# EAGLE design CT_main (EAGLE 9.6.2)
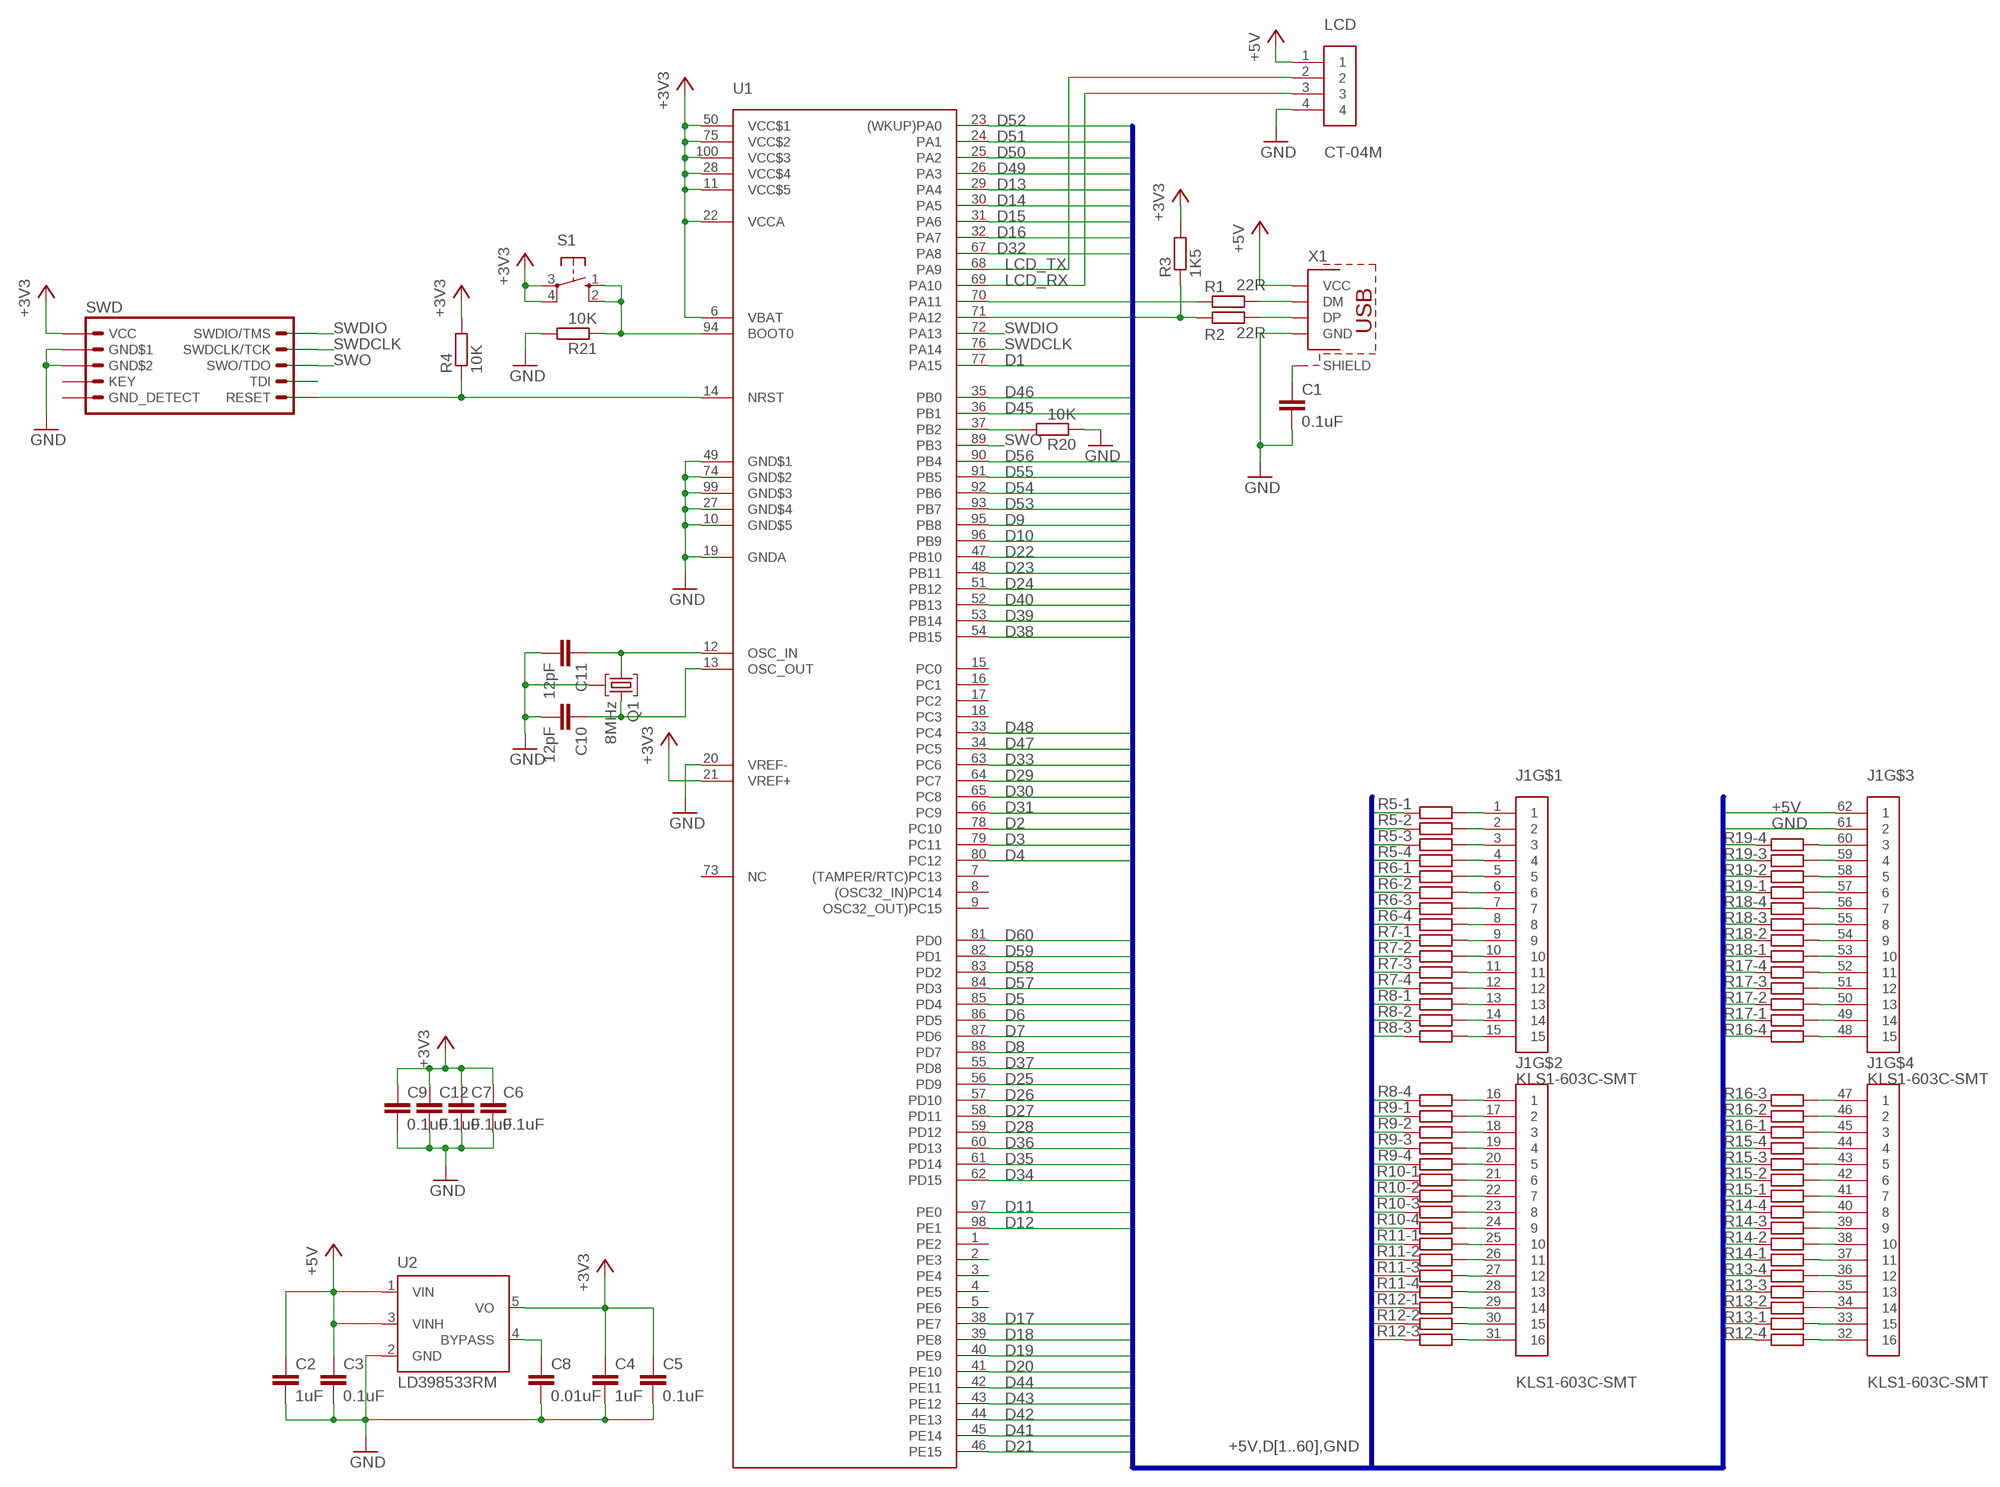
[diagram p0: schematic, sheet 1]

## Parts
C1  0.1uF  C-EU_0603  [C0603]
C2  1uF  C-EU_0603  [C0603]
C3  0.1uF  C-EU_0603  [C0603]
C4  1uF  C-EU_0603  [C0603]
C5  0.1uF  C-EU_0603  [C0603]
C6  0.1uF  C-EU_0603  [C0603]
C7  0.1uF  C-EU_0603  [C0603]
C8  0.01uF  C-EU_0603  [C0603]
C9  0.1uF  C-EU_0603  [C0603]
C10  12pF  C-EU_0603  [C0603]
C11  12pF  C-EU_0603  [C0603]
C12  0.1uF  C-EU_0603  [C0603]
J1  KLS1-603C-SMT  [KLS1-603C-SMT]
LCD  CT-04M  [CT-04M]
Q1  8MHz  CRYSTALKX-7_12.XXXXX  [KX-7_12.XXXXX]
R1  22R  R-EU__0603  [R0603]
R2  22R  R-EU__0603  [R0603]
R3  1K5  R-EU__0603  [R0603]
R4  10K  R-EU__0603  [R0603]
R5  R_EU_4_R1206  [R1206_4]
R6  R_EU_4_R1206  [R1206_4]
R7  R_EU_4_R1206  [R1206_4]
R8  R_EU_4_R1206  [R1206_4]
R9  R_EU_4_R1206  [R1206_4]
R10  R_EU_4_R1206  [R1206_4]
R11  R_EU_4_R1206  [R1206_4]
R12  R_EU_4_R1206  [R1206_4]
R13  R_EU_4_R1206  [R1206_4]
R14  R_EU_4_R1206  [R1206_4]
R15  R_EU_4_R1206  [R1206_4]
R16  R_EU_4_R1206  [R1206_4]
R17  R_EU_4_R1206  [R1206_4]
R18  R_EU_4_R1206  [R1206_4]
R19  R_EU_4_R1206  [R1206_4]
R20  10K  R-EU__0603  [R0603]
R21  10K  R-EU__0603  [R0603]
S1  10-XXDTSM-20  [DTSM20]
SWD  JTAG/SWD_10PIN  [ML10]
U1  STM32F1xx  STM32F101XX-LQFP100  [LQFP100]
U2  LD398533RM  [SOT23-5L]
X1  USBMICRO-B  [MOLEX-47364-0001]

## Nets
+3V3: C4.1 C5.1 C6.1 C7.1 C9.1 C12.1 R3.2 R4.2 S1.3(P) S1.4(P1) SWD.1(VCC) U1.6(VBAT) U1.11(VCC$5) U1.21(VREF+) U1.22(VCCA) U1.28(VCC$4) U1.50(VCC$1) U1.75(VCC$2) U1.100(VCC$3) U2.5(VO)
+5V: C2.1 C3.1 J1.62 LCD.1 U2.1(VIN) U2.3(VINH) X1.1(VCC)
D1: R5.8 U1.77(PA15)
D2: R5.7 U1.78(PC10)
D3: R5.6 U1.79(PC11)
D4: R5.5 U1.80(PC12)
D5: R6.8 U1.85(PD4)
D6: R6.7 U1.86(PD5)
D7: R6.6 U1.87(PD6)
D8: R6.5 U1.88(PD7)
D9: R7.8 U1.95(PB8)
D10: R7.7 U1.96(PB9)
D11: R7.6 U1.97(PE0)
D12: R7.5 U1.98(PE1)
D13: R8.8 U1.29(PA4)
D14: R8.7 U1.30(PA5)
D15: R8.6 U1.31(PA6)
D16: R8.5 U1.32(PA7)
D17: R9.8 U1.38(PE7)
D18: R9.7 U1.39(PE8)
D19: R9.6 U1.40(PE9)
D20: R9.5 U1.41(PE10)
D21: R10.8 U1.46(PE15)
D22: R10.7 U1.47(PB10)
D23: R10.6 U1.48(PB11)
D24: R10.5 U1.51(PB12)
D25: R11.8 U1.56(PD9)
D26: R11.7 U1.57(PD10)
D27: R11.6 U1.58(PD11)
D28: R11.5 U1.59(PD12)
D29: R12.8 U1.64(PC7)
D30: R12.7 U1.65(PC8)
D31: R12.6 U1.66(PC9)
D32: R12.5 U1.67(PA8)
D33: R13.1 U1.63(PC6)
D34: R13.2 U1.62(PD15)
D35: R13.3 U1.61(PD14)
D36: R13.4 U1.60(PD13)
D37: R14.1 U1.55(PD8)
D38: R14.2 U1.54(PB15)
D39: R14.3 U1.53(PB14)
D40: R14.4 U1.52(PB13)
D41: R15.1 U1.45(PE14)
D42: R15.2 U1.44(PE13)
D43: R15.3 U1.43(PE12)
D44: R15.4 U1.42(PE11)
D45: R16.1 U1.36(PB1)
D46: R16.2 U1.35(PB0)
D47: R16.3 U1.34(PC5)
D48: R16.4 U1.33(PC4)
D49: R17.1 U1.26(PA3)
D50: R17.2 U1.25(PA2)
D51: R17.3 U1.24(PA1)
D52: R17.4 U1.23((WKUP)PA0)
D53: R18.1 U1.93(PB7)
D54: R18.2 U1.92(PB6)
D55: R18.3 U1.91(PB5)
D56: R18.4 U1.90(PB4)
D57: R19.1 U1.84(PD3)
D58: R19.2 U1.83(PD2)
D59: R19.3 U1.82(PD1)
D60: R19.4 U1.81(PD0)
GND: C1.2 C2.2 C3.2 C4.2 C5.2 C6.2 C7.2 C8.2 C9.2 C10.2 C11.2 C12.2 J1.61 LCD.4 Q1.2 Q1.4 R20.1 R21.2 SWD.3(GND$1) SWD.5(GND$2) U1.10(GND$5) U1.19(GNDA) U1.20(VREF-) U1.27(GND$4) U1.49(GND$1) U1.74(GND$2) U1.99(GND$3) U2.2(GND) X1.5(GND)
LCD_RX: LCD.3 U1.69(PA10)
LCD_TX: LCD.2 U1.68(PA9)
N$1: R1.2 X1.2(DM)
N$2: R2.2 X1.3(DP)
N$3: C8.1 U2.4(BYPASS)
N$4: J1.1 R5.1
N$5: R1.1 U1.70(PA11)
N$6: R2.1 R3.1 U1.71(PA12)
N$7: R4.1 SWD.10(RESET) U1.14(NRST)
N$8: C10.1 Q1.3 U1.13(OSC_OUT)
N$9: C11.1 Q1.1 U1.12(OSC_IN)
N$10: J1.2 R5.2
N$11: J1.3 R5.3
N$12: J1.4 R5.4
N$13: J1.8 R6.4
N$14: J1.7 R6.3
N$15: J1.6 R6.2
N$16: J1.5 R6.1
N$17: J1.9 R7.1
N$18: J1.10 R7.2
N$19: J1.11 R7.3
N$20: J1.12 R7.4
N$21: J1.13 R8.1
N$22: J1.17 R9.1
N$23: J1.18 R9.2
N$24: J1.19 R9.3
N$25: J1.20 R9.4
N$26: J1.21 R10.1
N$27: J1.22 R10.2
N$28: J1.23 R10.3
N$29: J1.27 R11.3
N$30: J1.28 R11.4
N$31: J1.29 R12.1
N$32: J1.30 R12.2
N$33: J1.31 R12.3
N$34: J1.26 R11.2
N$35: J1.25 R11.1
N$36: J1.24 R10.4
N$37: J1.14 R8.2
N$38: J1.15 R8.3
N$39: J1.16 R8.4
N$40: J1.32 R12.4
N$41: J1.33 R13.8
N$42: J1.34 R13.7
N$43: J1.35 R13.6
N$44: J1.36 R13.5
N$45: J1.37 R14.8
N$46: J1.38 R14.7
N$47: J1.39 R14.6
N$48: J1.40 R14.5
N$49: J1.41 R15.8
N$50: J1.42 R15.7
N$51: J1.43 R15.6
N$52: J1.44 R15.5
N$53: J1.45 R16.8
N$54: J1.46 R16.7
N$55: J1.47 R16.6
N$56: J1.60 R19.5
N$57: J1.59 R19.6
N$58: J1.58 R19.7
N$59: J1.57 R19.8
N$60: J1.56 R18.5
N$61: J1.55 R18.6
N$62: J1.54 R18.7
N$63: J1.53 R18.8
N$64: J1.52 R17.5
N$65: J1.51 R17.6
N$66: J1.50 R17.7
N$67: J1.49 R17.8
N$68: J1.48 R16.5
N$73: R20.2 U1.37(PB2)
N$75: R21.1 S1.1(S) S1.2(S1) U1.94(BOOT0)
SHIELD: C1.1 X1.GND1(SHIELD) X1.GND2(SHIELD) X1.GND3(SHIELD) X1.GND4(SHIELD)
SWDCLK: SWD.4(SWDCLK/TCK) U1.76(PA14)
SWDIO: SWD.2(SWDIO/TMS) U1.72(PA13)
SWO: SWD.6(SWO/TDO) U1.89(PB3)
Unconnected: SWD.7(KEY) SWD.8(TDI) U1.1(PE2) U1.2(PE3) U1.3(PE4) U1.4(PE5) U1.5(PE6) U1.7((TAMPER/RTC)PC13) U1.8((OSC32_IN)PC14) U1.9(OSC32_OUT)PC15) U1.15(PC0) U1.16(PC1) U1.17(PC2) U1.18(PC3) U1.73(NC)

## Buses
+5V,D[1..60],GND

## Power pins joined to a net without a drawn wire
GND_DETECT: SWD.9(GND_DETECT)

## Library data of the parts
C1-C12 = snx_rlc:C-EU
J1 = snx_con:KLS1-603C
LCD = snx_con:CT-04
Q1 = snx_setup:CRYSTAL
R1-R4 R20 R21 = snx_rlc:R-EU_
R5-R19 = snx_rlc:R_EU_4
S1 = snx_btn:10-XX: OMRON SWITCH
SWD = snx_con:JTAG/SWD_10PIN; OC_FARNELL: unknown; OC_NEWARK: unknown
U1 = snx_stm32:STM32F101XX-LQFP100
U2 = snx_microchip:LD3985: Ultra low drop and low noise BiCMOS voltage regulators Source: www.st.com LD3985.pdf
X1 = snx_con:USB: USB-B connector

## Board
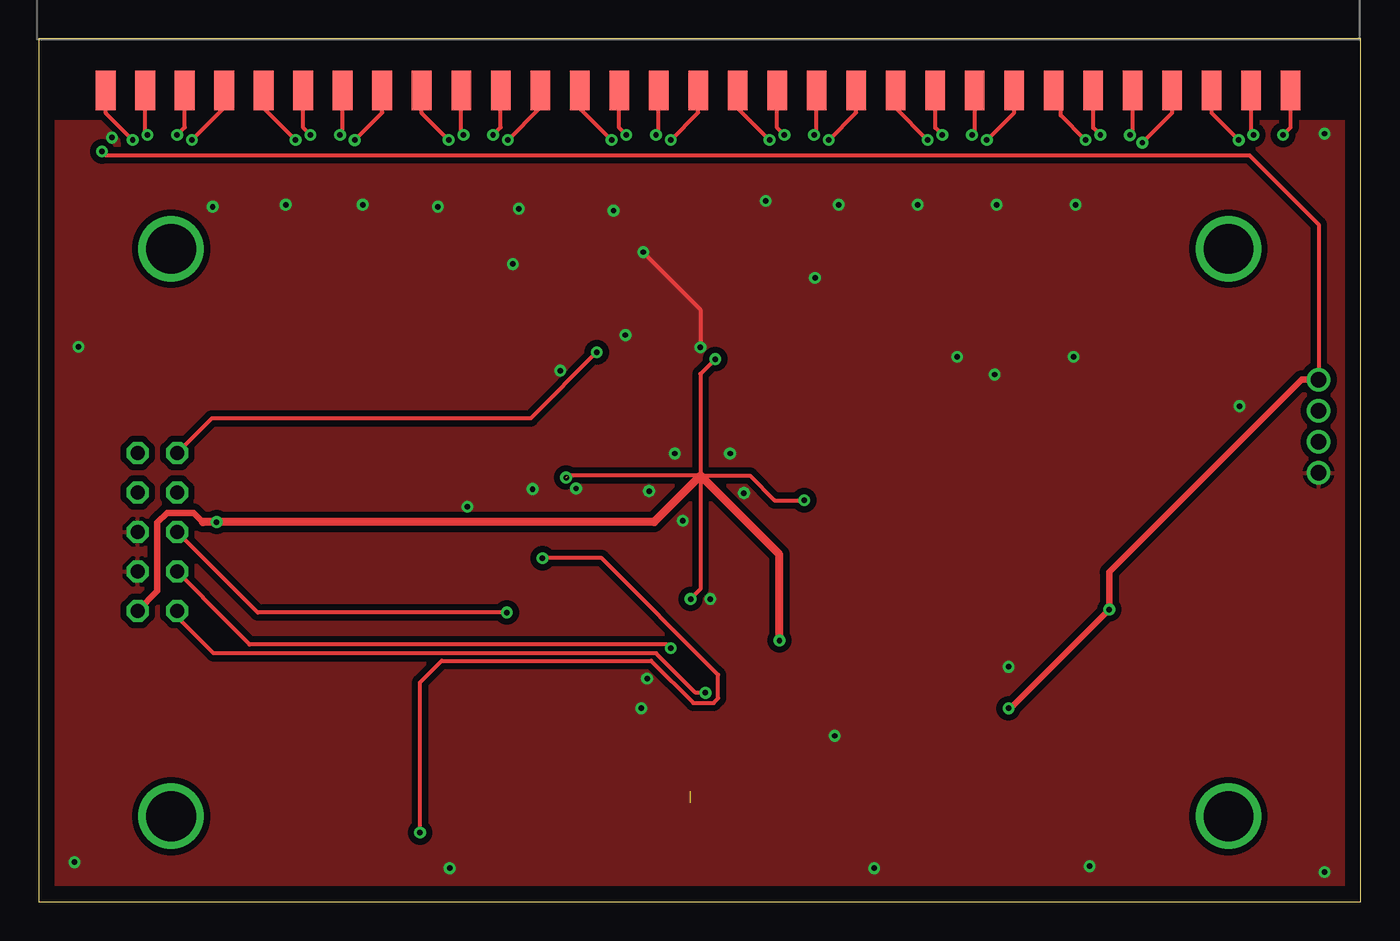
[diagram p1: board, top side]
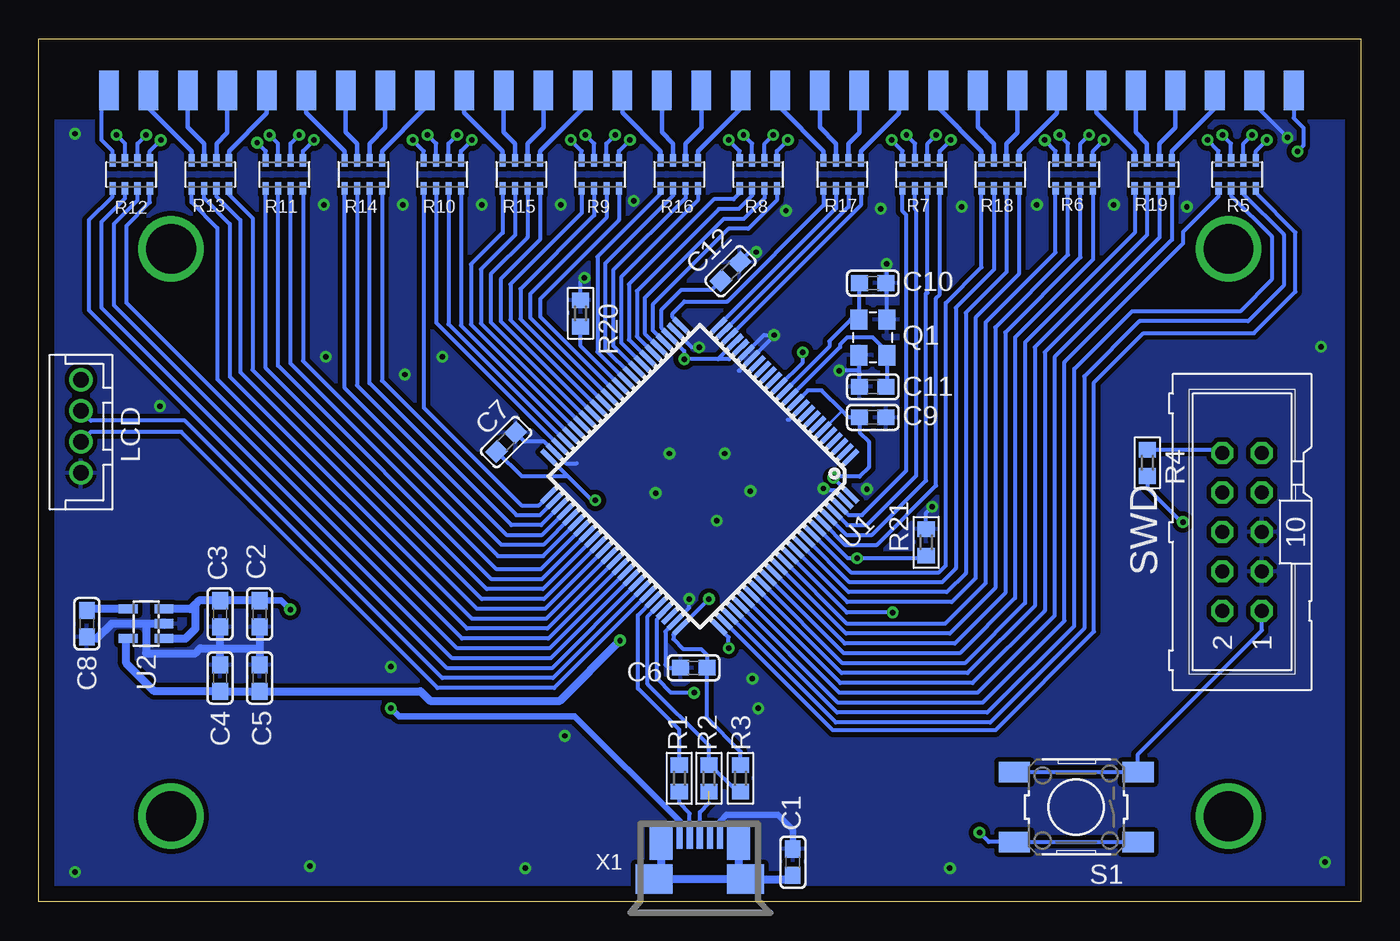
[diagram p2: board, bottom side, seen from below]

Size 85 x 55.5 mm. Coordinates in mm from the lower left corner, seen from the top.
Outline: 0,0 85,0 85,55.5 0,55.5 0,0
Copper layers (1*16): Top 0.035mm / dielectric 1.5mm / Bottom 0.035mm
Design rules "default": minimum track width 6mil, minimum drill 0.35mm, track to track 6mil, track to pad 6mil, pad to pad 6mil, via to via 6mil, smd to smd 6mil, copper to edge 40mil, drill to drill 6mil, minimum pad ring 10mil, minimum via ring 8mil, stop-mask expansion 4mil, vias tented up to drill 0mil, thermal gap 10mil

### Footprints (pad centres in the part's own frame; a part is rotated, then mirrored left to right if it is on the bottom)
C0603 = smd 1.1 x 1: 1 -0.85,0; 2 0.85,0
KLS1-603C-SMT = smd 1.27 x 2.54: 1 -38.1,0; 2 -35.56,0; 3 -33.02,0; 4 -30.48,0; 5 -27.94,0; 6 -25.4,0; 7 -22.86,0; 8 -20.32,0; 9 -17.78,0; 10 -15.24,0; 11 -12.7,0; 12 -10.16,0; 13 -7.62,0; 14 -5.08,0; 15 -2.54,0; 16 0,0; 17 2.54,0; 18 5.08,0; 19 7.62,0; 20 10.16,0; 21 12.7,0; 22 15.24,0; 23 17.78,0; 24 20.32,0; 25 22.86,0; 26 25.4,0; 27 27.94,0; 28 30.48,0; 29 33.02,0; 30 35.56,0; 31 38.1,0 | smd 1.27 x 2.54 bottom: 32 38.1,0; 33 35.56,0; 34 33.02,0; 35 30.48,0; 36 27.94,0; 37 25.4,0; 38 22.86,0; 39 20.32,0; 40 17.78,0; 41 15.24,0; 42 12.7,0; 43 10.16,0; 44 7.62,0; 45 5.08,0; 46 2.54,0; 47 0,0; 48 -2.54,0; 49 -5.08,0; 50 -7.62,0; 51 -10.16,0; 52 -12.7,0; 53 -15.24,0; 54 -17.78,0; 55 -20.32,0; 56 -22.86,0; 57 -25.4,0; 58 -27.94,0; 59 -30.48,0; 60 -33.02,0; 61 -35.56,0; 62 -38.1,0
CT-04M = drill 1: 1 -3,0; 2 -1,0; 3 1,0; 4 3,0
KX-7_12.XXXXX = smd 1.3 x 1.1: 1 -1.15,-0.9; 2 1.15,-0.9; 3 1.15,0.9; 4 -1.15,0.9
R0603 = smd 1 x 1.1: 1 -0.85,0; 2 0.85,0
R1206_4 = smd 0.4 x 0.8: 1 -1.2,-0.9; 2 -0.4,-0.9; 3 0.4,-0.9; 4 1.2,-0.9; 5 1.2,0.9; 6 0.4,0.9; 7 -0.4,0.9; 8 -1.2,0.9
DTSM20 = smd 2 x 1.3: 1 -3.975,2.25; 2 3.975,2.25; 3 -3.975,-2.25; 4 3.975,-2.25
ML10 = drill 0.914 octagon: 1 -5.08,-1.27; 2 -5.08,1.27; 3 -2.54,-1.27; 4 -2.54,1.27; 5 0,-1.27; 6 0,1.27; 7 2.54,-1.27; 8 2.54,1.27; 9 5.08,-1.27; 10 5.08,1.27
LQFP100 = smd 1.2 x 0.32: 1 -7.75,6; 2 -7.75,5.5; 3 -7.75,5; 4 -7.75,4.5; 5 -7.75,4; 6 -7.75,3.5; 7 -7.75,3; 8 -7.75,2.5; 9 -7.75,2; 10 -7.75,1.5; 11 -7.75,1; 12 -7.75,0.5; 13 -7.75,0; 14 -7.75,-0.5; 15 -7.75,-1; 16 -7.75,-1.5; 17 -7.75,-2; 18 -7.75,-2.5; 19 -7.75,-3; 20 -7.75,-3.5; 21 -7.75,-4; 22 -7.75,-4.5; 23 -7.75,-5; 24 -7.75,-5.5; 25 -7.75,-6; 51 7.75,-6; 52 7.75,-5.5; 53 7.75,-5; 54 7.75,-4.5; 55 7.75,-4; 56 7.75,-3.5; 57 7.75,-3; 58 7.75,-2.5; 59 7.75,-2; 60 7.75,-1.5; 61 7.75,-1; 62 7.75,-0.5; 63 7.75,0; 64 7.75,0.5; 65 7.75,1; 66 7.75,1.5; 67 7.75,2; 68 7.75,2.5; 69 7.75,3; 70 7.75,3.5; 71 7.75,4; 72 7.75,4.5; 73 7.75,5; 74 7.75,5.5; 75 7.75,6 | smd 0.32 x 1.2: 26 -6,-7.75; 27 -5.5,-7.75; 28 -5,-7.75; 29 -4.5,-7.75; 30 -4,-7.75; 31 -3.5,-7.75; 32 -3,-7.75; 33 -2.5,-7.75; 34 -2,-7.75; 35 -1.5,-7.75; 36 -1,-7.75; 37 -0.5,-7.75; 38 0,-7.75; 39 0.5,-7.75; 40 1,-7.75; 41 1.5,-7.75; 42 2,-7.75; 43 2.5,-7.75; 44 3,-7.75; 45 3.5,-7.75; 46 4,-7.75; 47 4.5,-7.75; 48 5,-7.75; 49 5.5,-7.75; 50 6,-7.75; 76 6,7.75; 77 5.5,7.75; 78 5,7.75; 79 4.5,7.75; 80 4,7.75; 81 3.5,7.75; 82 3,7.75; 83 2.5,7.75; 84 2,7.75; 85 1.5,7.75; 86 1,7.75; 87 0.5,7.75; 88 0,7.75; 89 -0.5,7.75; 90 -1,7.75; 91 -1.5,7.75; 92 -2,7.75; 93 -2.5,7.75; 94 -3,7.75; 95 -3.5,7.75; 96 -4,7.75; 97 -4.5,7.75; 98 -5,7.75; 99 -5.5,7.75; 100 -6,7.75
SOT23-5L = smd 0.6 x 1.2: 1 -0.95,-1.15; 2 0,-1.15; 3 0.95,-1.15; 4 0.95,1.15; 5 -0.95,1.15
MOLEX-47364-0001 = smd 1.7 x 0.4: 1 2.8,1.3; 2 2.8,0.65; 3 2.8,0; 4 2.8,-0.65; 5 2.8,-1.3 | smd 1.9 x 2.375: GND1 0,2.95; GND4 0,-2.95 | smd 2.1 x 1.475: GND2 2.3,2.5; GND3 2.3,-2.5

### Placement (x,y rotation side)
C1  36.51,2.54 90 bottom
C2  70.8,18.52 270 bottom
C3  73.34,18.52 270 bottom
C4  73.34,14.39 90 bottom
C5  70.8,14.39 90 bottom
C6  42.89,15.05 180 bottom
C7  54.96,29.57 45 bottom
C8  81.92,17.88 270 bottom
C9  31.37,31.16 0 bottom
C10  31.37,39.79 0 bottom
C11  31.37,33.12 180 bottom
C12  40.53,40.55 45 bottom
J1  42.4,52.17 0 top
LCD  82.3,30.58 270 bottom
Q1  31.37,36.3 90 bottom
R1  43.81,7.94 270 bottom
R2  41.91,7.94 270 bottom
R3  39.88,7.94 90 bottom
R4  13.72,28.24 270 bottom
R5  7.94,46.78 180 bottom
R6  18.41,46.78 180 bottom
R7  28.26,46.78 180 bottom
R8  38.73,46.78 180 bottom
R9  48.9,46.78 180 bottom
R10  59.05,46.78 180 bottom
R11  69.22,46.78 180 bottom
R12  79.06,46.78 180 bottom
R13  73.98,46.78 0 bottom
R14  64.14,46.78 0 bottom
R15  53.98,46.78 0 bottom
R16  43.81,46.78 0 bottom
R17  33.34,46.78 0 bottom
R18  23.18,46.78 0 bottom
R19  13.34,46.78 0 bottom
R20  50.16,37.85 270 bottom
R21  27.94,23.12 90 bottom
S1  18.29,6.1 180 bottom
SWD  7.62,23.79 90 bottom
U1  42.5,27.36 225 bottom
U2  78.11,17.88 90 bottom
X1  42.5,1.45 90 bottom

### Tracks (layer width: path | path; a pad name or v marks a point on that pad's centre or on a via)
+3V3  (via drill 0.35)  (1 unrouted)
  Top 0.254: v43.5,34.9 42.55,33.95 42.55,27.41 | 42.55,27.41 34.04,27.41 v33.91,27.28 | 42.55,27.41 45.72,27.41 47.31,25.82 v49.21,25.82 | 42.55,27.41 42.55,20.11 v41.91,19.47
  Top 0.406: SWD.1 7.62,19.98 7.62,24.39 8.26,25.02 9.95,25.02 10.54,24.43
  Top 0.508: v47.62,16.81 47.62,22.33 42.55,27.41 39.56,24.43 v11.43,24.43 10.54,24.43
  Bottom 0.203: U1.6 33.35,31.56 33.34,31.56
  Bottom 0.254: U1.50 50.99,27.37 | 50.99,27.37 49.44,25.82 v49.21,25.82 | v41.91,19.47 U1.75 44.2,17.18 44.2,16.89 43.56,16.26 42.42,16.26 42.04,15.88 C6.1 42.04,11.82 39.88,9.65 R3.2 | U1.100 34,27.35 | v33.91,27.28 33.91,27.35 32.22,27.35 31.62,27.94 31.62,29.59 32.22,30.19 C9.1 32.93,31.16 33.34,31.56 34.67,32.9 35.55,32.9 U1.11 | C12.1 41.71,39.37 43.69,39.37 44.96,38.1 44.96,36.89 U1.28 43.5,35.43 v43.5,34.9 41.33,34.9 | C7.1 53.95,27.37 50.99,27.37 | v11.43,24.43 11.52,24.43 13.72,26.62 R4.2 | S1.4 S1.3 14.31,9.49 6.35,17.45 SWD.1 | U1.22 41.33,34.9 | U1.21 40.62,34.9 41.33,34.9
  Bottom 0.508: U2.5 79.38,16.81 79.38,15.34 77.57,13.54 C4.1 C5.1 60.47,13.54 59.86,12.93 51.5,12.93 v47.62,16.81
+5V  (via drill 0.35)
  Top 0.254: v4.06,48.26 4.32,48.01 77.85,48.01 82.3,43.56 LCD.1
  Top 0.406: v62.36,12.45 62.48,12.45 v68.83,18.8 68.83,21.21 81.21,33.59 LCD.1
  Bottom 0.254: J1.62 4.3,50.4 3.68,49.79 3.68,48.64 v4.06,48.26
  Bottom 0.406: X1.1 43.8,5.19 50.55,11.94 61.85,11.94 v62.36,12.45 | v68.83,18.8 69.41,19.37 C2.1
  Bottom 0.508: C2.1 C3.1 74.72,19.37 74.93,19.15 | U2.3 75.25,18.83 74.93,19.15 | U2.1 75.56,16.93 74.93,17.57 74.93,19.15
D1
  Bottom 0.254: U1.77 33.94,11.03 23.5,11.03 17.14,17.38 17.14,33.4 13.97,36.58 6.86,36.58 4.19,39.25 4.19,43.06 6.74,45.6 R5.8
D2
  Bottom 0.254: U1.78 33.74,11.54 23.81,11.54 17.78,17.57 17.78,33.78 14.22,37.34 7.24,37.34 4.95,39.63 4.95,42.93 7.54,45.51 R5.7
D3
  Bottom 0.254: U1.79 33.67,12.17 24,12.17 18.41,17.76 18.41,34.27 14.71,37.98 7.75,37.98 5.71,40.01 5.71,42.8 8.34,45.42 R5.6
D4
  Bottom 0.254: U1.80 33.6,12.81 24.32,12.81 19.05,18.08 19.05,34.71 11.42,42.34 11.42,43.08 9.14,45.37 R5.5
D5
  Bottom 0.254: U1.85 33.24,15.98 25.78,15.98 22.23,19.54 22.23,36.3 17.21,41.31 R6.8
D6
  Bottom 0.254: U1.86 33.16,16.62 26.1,16.62 22.86,19.85 22.86,36.62 18.02,41.46 R6.7
D7
  Bottom 0.254: U1.87 33.09,17.25 26.42,17.25 23.5,20.17 23.5,36.93 18.82,41.61 R6.6
D8
  Bottom 0.254: U1.88 33.02,17.89 26.73,17.89 24.13,20.49 24.13,37.25 19.61,41.77 R6.5
D9
  Bottom 0.254: U1.95 33.15,22.96 31.11,22.96 27.3,26.78 27.3,38.82 27.06,39.06 R7.8
D10
  Bottom 0.254: U1.96 33.08,23.6 31.43,23.6 27.94,27.09 27.94,39.16 27.86,39.16 R7.7
D11
  Bottom 0.254: U1.97 33.01,24.24 31.75,24.24 28.57,27.41 28.57,44.46 28.66,44.54 R7.6
D12
  Bottom 0.254: U1.98 32.93,24.87 32.07,24.87 29.21,27.73 29.21,44.17 29.46,44.42 R7.5
D13
  Bottom 0.254: R8.8 37.53,45.12 39.37,43.28 40.64,43.28 45.53,38.4 45.53,36.76 U1.29
D14
  Bottom 0.254: R8.7 38.34,45.27 39.69,43.92 40.96,43.92 46.04,38.84 46.04,36.56 U1.30
D15
  Bottom 0.254: R8.6 39.13,45.42 40.01,44.56 41.27,44.56 46.55,39.28 46.55,36.36 U1.31
D16
  Bottom 0.254: R8.5 39.94,45.58 40.32,45.19 41.59,45.19 47.05,39.73 47.05,36.16 U1.32
D17
  Bottom 0.254: R9.8 47.7,43.85 52.77,38.78 52.77,37.63 U1.38
D18
  Bottom 0.254: R9.7 48.49,44 53.4,39.09 53.4,37.56 U1.39
D19
  Bottom 0.254: R9.6 49.3,44.16 54.04,39.41 54.04,37.49 U1.40
D20
  Bottom 0.254: R9.5 50.09,44.31 54.67,39.73 54.67,37.42 U1.41
D21
  Bottom 0.254: R10.8 57.85,37.06 U1.46
D22
  Bottom 0.254: R10.7 58.66,37.16 U1.47
D23
  Bottom 0.254: R10.6 59.45,37.25 U1.48
D24
  Bottom 0.254: R10.5 60.26,31.78 53.98,25.51 52.84,25.51 U1.51
D25
  Bottom 0.254: R11.8 68.02,34.78 55.47,22.24 52.57,22.24 U1.56
D26
  Bottom 0.254: U1.57 52.73,21.38 55.56,21.38 68.81,34.63 R11.7
D27
  Bottom 0.254: U1.58 52.66,20.74 55.88,20.74 69.61,34.48 R11.6
D28
  Bottom 0.254: U1.59 52.59,20.11 56.2,20.11 70.42,34.32 R11.5
D29
  Bottom 0.254: U1.64 52.23,16.93 57.78,16.93 79.38,38.53 79.38,43.46 77.86,44.99 R12.8
D30
  Bottom 0.254: U1.65 52.15,16.3 58.1,16.3 80.18,38.38 80.18,43.59 78.66,45.12 R12.7
D31
  Bottom 0.254: U1.66 52.08,15.66 58.42,15.66 80.98,38.22 80.98,43.72 79.46,45.24 R12.6
D32
  Bottom 0.254: U1.67 52.01,15.03 58.74,15.03 81.78,38.07 81.78,43.85 80.26,45.37 R12.5
D33
  Bottom 0.254: U1.63 52.3,17.57 57.47,17.57 73.53,33.63 73.53,43.34 75.18,44.99 R13.1
D34
  Bottom 0.254: U1.62 52.37,18.2 57.15,18.2 72.73,33.78 72.73,43.59 74.38,45.24 R13.2
D35
  Bottom 0.254: U1.61 52.44,18.84 56.83,18.84 72.05,34.06 72.05,43.85 73.58,45.37 R13.3
D36
  Bottom 0.254: U1.60 52.51,19.47 56.52,19.47 71.25,34.21 71.25,43.97 72.78,45.5 R13.4
D37
  Bottom 0.254: U1.55 52.56,22.96 55.24,22.96 65.33,33.06 R14.1
D38
  Bottom 0.254: R14.2 64.53,33.21 54.93,23.6 52.63,23.6 U1.54
D39
  Bottom 0.254: U1.53 52.7,24.24 54.61,24.24 63.73,33.36 R14.3
D40
  Bottom 0.254: R14.4 62.94,33.51 54.29,24.87 52.77,24.87 U1.52
D41
  Bottom 0.254: R15.1 55.17,43.04 57.21,41 57.21,37.13 U1.45
D42
  Bottom 0.254: R15.2 54.38,42.89 56.58,40.68 56.58,37.2 U1.44
D43
  Bottom 0.254: R15.3 53.58,42.73 55.94,40.36 55.94,37.27 U1.43
D44
  Bottom 0.254: R15.4 52.77,42.58 55.31,40.05 55.31,37.35 U1.42
D45
  Bottom 0.254: R16.1 45.02,45.56 49.09,41.49 49.09,35.36 U1.36
D46
  Bottom 0.254: R16.2 44.22,45.42 48.58,41.06 48.58,35.56 U1.35
D47
  Bottom 0.254: R16.3 43.41,45.27 48.07,40.62 48.07,35.76 U1.34
D48
  Bottom 0.254: R16.4 42.62,45.12 47.56,40.17 47.56,35.96 U1.33
D49
  Bottom 0.254: R17.1 34.54,44.8 40.73,38.61 43.48,38.61 44.24,37.85 44.24,37.6 U1.26
D50
  Bottom 0.254: U1.25 33.74,44.61 R17.2
D51
  Bottom 0.254: R17.3 32.94,44.71 U1.24
D52
  Bottom 0.254: R17.4 32.14,44.8 U1.23
D53
  Bottom 0.254: U1.93 32.79,21.19 27.11,21.19 26.67,21.63 26.67,38.52 24.38,40.81 R18.1
D54
  Bottom 0.254: R18.2 23.58,40.66 26.04,38.21 26.04,21.44 26.92,20.55 32.86,20.55 U1.92
D55
  Bottom 0.254: R18.3 22.78,40.51 25.4,37.89 25.4,21.12 26.61,19.92 32.93,19.92 U1.91
D56
  Bottom 0.254: R18.4 21.98,40.36 24.77,37.57 24.77,20.81 26.29,19.28 33,19.28 U1.90
D57
  Bottom 0.254: R19.1 14.54,43.04 21.59,35.98 21.59,19.22 25.46,15.34 33.31,15.34 U1.84
D58
  Bottom 0.254: R19.2 13.73,42.89 20.95,35.67 20.95,19.03 25.27,14.71 33.38,14.71 U1.83
D59
  Bottom 0.254: R19.3 12.94,42.73 20.32,35.35 20.32,18.71 24.96,14.07 33.45,14.07 U1.82
D60
  Bottom 0.254: R19.4 12.13,42.58 19.68,35.03 19.68,18.39 24.64,13.44 33.52,13.44 U1.81
GND  (via drill 0.35)
  Top 0.254: v38.86,41.79 42.55,38.1 v42.55,35.67
  Bottom 0.254: C10.2 30.47,39.74 Q1.2 30.47,37.2 | C11.2 32.22,34.04 | 32.22,34.04 32.22,35.1 Q1.4 32.27,35.4 | U1.27 43.02,35.67 v42.55,35.67 | U1.99 33.81,26.46 34.42,26.46 v34.54,26.58 | v43.18,19.47 43.18,18.91 U1.74 44.7,17.38 44.7,15.24 44.51,15.05 C6.2 | C12.2 39.3,41.79 v38.86,41.79 | 32.22,34.04 32.35,34.17 v33.53,34.17 | C10.2 30.61,39.88 | v30.48,41.02 30.48,39.83 C10.2 | J1.61 6.84,51.29 v4.7,49.15 | U1.10 36.75,30.99 36.83,30.99 | 40.01,34.17 39.94,34.17 U1.19 37.72,36.39 v37.72,36.45 38.36,36.45 U1.20 | C7.2 53.77,29.59 52.51,29.59 U1.49 51.11,28.2 50.42,28.2 | R20.1 50.16,39.88 v49.91,40.13 | R21.2 27.94,25.02 v27.56,25.4
  Bottom 0.406: X1.5 41.2,5.16 40.77,5.59 37.47,5.59 36.51,4.64 C1.2
  Bottom 0.508: C2.2 70.8,16.3 | 70.8,16.3 C5.2 | C4.2 73.34,16.3 | 73.34,16.3 C3.2 73.56,17.89 | 73.34,16.3 70.8,16.3 | U2.2 78.11,17.89 | 78.11,17.89 80.33,17.89 81.28,16.93 81.81,16.93 C8.2 | 78.11,17.89 78.11,15.98 74.93,15.98 74.61,16.3 73.34,16.3
  other vias: 11.18,44.71 15.88,44.83 20.83,44.83 25.65,44.71 30.86,44.58 2.54,35.69 36.96,44.45 46.74,45.09 51.44,44.83 66.55,35.05 59.05,35.05 61.47,33.91 61.59,44.83 56.52,44.83 66.67,44.83 82.68,49.41 77.22,31.88 38.73,12.45 39.12,14.35 51.18,10.67 62.36,15.12 41.4,24.51 39.24,26.42 40.89,28.83 31.75,26.55 45.34,26.29 44.45,28.83 67.56,2.29 53.72,2.16 82.68,1.91 26.42,2.16 2.29,2.54
  pour Bottom (isolate 0.3): -1.27,50.17 86.87,50.17 86.87,-1.52 -1.27,-1.52
  pour Top (isolate 0.4): -1.27,50.17 86.87,50.17 86.87,-1.52 -1.27,-1.52
LCD_RX
  Bottom 0.254: U1.69 51.87,13.76 59.37,13.76 75.83,30.22 81.66,30.22 LCD.3
LCD_TX
  Bottom 0.254: U1.68 51.94,14.39 59.05,14.39 75.61,30.95 81.66,30.95 LCD.2
N$1
  Bottom 0.254: X1.2 43.15,5.69 43.81,6.35 R1.2
N$2  (1 unrouted)
  Bottom 0.254: X1.3 42.5,5.76 41.91,6.35
N$3
  Bottom 0.508: C8.1 81.81,18.83 U2.4
N$4  (via drill 0.35)
  Top 0.254: v6.03,49 4.3,50.73 J1.1
  Bottom 0.254: R5.1 6.74,48.29 v6.03,49
N$5
  Bottom 0.254: R1.1 43.81,11.05 46.48,13.72 46.48,18.43 U1.70
N$6
  Bottom 0.254: U1.71 45.85,18.36 45.85,14 41.91,10.06 R2.1 41.81,8.79 40.11,7.09 R3.1
N$7  (via drill 0.35)
  Top 0.254: v35.88,35.35 31.62,31.09 11.11,31.09 SWD.10
  Bottom 0.254: U1.14 35.88,34.69 v35.88,35.35 | R4.1 9.11,29.09 SWD.10
N$8
  Bottom 0.254: C10.1 32.27,39.74 Q1.3 32.78,37.45 34.16,36.06 34.16,35.7 U1.13
N$9
  Bottom 0.254: C11.1 30.47,33.17 Q1.1 30.47,35.4 31.37,36.3 33.03,36.3 33.48,35.85 33.48,35.68 U1.12
N$10  (via drill 0.35)
  Top 0.254: v6.99,49.32 6.84,49.46 J1.2
  Bottom 0.254: R5.2 7.54,48.77 v6.99,49.32
N$11  (via drill 0.35)
  Top 0.254: J1.3 9.38,49.81 v8.89,49.32
  Bottom 0.254: R5.3 8.34,48.77 v8.89,49.32
N$12  (via drill 0.35)
  Top 0.254: v9.84,49 11.92,51.08 J1.4
  Bottom 0.254: R5.4 9.14,48.29 v9.84,49
N$13  (via drill 0.35)
  Top 0.254: v20.31,48.99 22.08,50.76 J1.8
  Bottom 0.254: R6.4 19.61,48.29 v20.31,48.99 v20.32,49
N$14  (via drill 0.35)
  Top 0.254: v19.37,49.32 19.54,49.49 J1.7
  Bottom 0.254: R6.3 18.82,48.77 v19.37,49.32
N$15  (via drill 0.35)
  Top 0.254: v17.46,49.32 17,49.78 J1.6
  Bottom 0.254: R6.2 18.02,48.77 v17.46,49.32
N$16  (via drill 0.35)
  Top 0.254: v16.51,49 14.46,51.05 J1.5
  Bottom 0.254: R6.1 17.21,48.29 v16.51,49
N$17  (via drill 0.35)
  Top 0.254: v26.35,49 24.62,50.73 J1.9
  Bottom 0.254: R7.1 27.06,48.29 v26.35,49
N$18  (via drill 0.35)
  Top 0.254: v27.3,49.32 27.16,49.46 J1.10
  Bottom 0.254: R7.2 27.86,48.77 v27.3,49.32
N$19  (via drill 0.35)
  Top 0.254: v29.21,49.32 29.7,49.81 J1.11
  Bottom 0.254: R7.3 28.66,48.77 v29.21,49.32
N$20  (via drill 0.35)
  Top 0.254: v30.16,49 32.24,51.08 J1.12
  Bottom 0.254: R7.4 29.46,48.29 v30.16,49
N$21  (via drill 0.35)
  Top 0.254: v36.83,49 34.78,51.05 J1.13
  Bottom 0.254: R8.1 37.53,48.29 v36.83,49
N$22  (via drill 0.35)
  Top 0.254: v46.99,49 44.94,51.05 J1.17
  Bottom 0.254: R9.1 47.7,48.29 v46.99,49
N$23  (via drill 0.35)
  Top 0.254: v47.94,49.32 47.48,49.78 J1.18
  Bottom 0.254: R9.2 48.49,48.77 v47.94,49.32
N$24  (via drill 0.35)
  Top 0.254: v49.85,49.32 50.02,49.49 J1.19
  Bottom 0.254: R9.3 49.3,48.77 v49.85,49.32
N$25  (via drill 0.35)
  Top 0.254: v50.8,49 52.56,50.76 J1.20
  Bottom 0.254: R9.4 50.09,48.29 v50.8,49
N$26  (via drill 0.35)
  Top 0.254: v57.15,49 55.1,51.05 J1.21
  Bottom 0.254: R10.1 57.85,48.29 v57.15,49
N$27  (via drill 0.35)
  Top 0.254: v58.1,49.32 57.64,49.78 J1.22
  Bottom 0.254: R10.2 58.66,48.77 v58.1,49.32
N$28  (via drill 0.35)
  Top 0.254: v60.01,49.32 60.18,49.49 J1.23
  Bottom 0.254: R10.3 59.45,48.77 v60.01,49.32
N$29  (via drill 0.35)
  Top 0.254: v70.16,49.31 70.34,49.49 J1.27
  Bottom 0.254: R11.3 69.61,48.77 v70.16,49.31 v70.17,49.32
N$30  (via drill 0.35)
  Top 0.254: v70.96,48.83 72.88,50.74 J1.28
  Bottom 0.254: R11.4 70.42,48.29 70.95,48.83 v70.96,48.83
N$31  (via drill 0.35)
  Top 0.254: v77.16,48.99 75.42,50.73 J1.29
  Bottom 0.254: R12.1 77.86,48.29 v77.16,48.99 v77.15,49
N$32  (via drill 0.35)
  Top 0.254: v78.11,49.32 77.96,49.46 J1.30
  Bottom 0.254: R12.2 78.66,48.77 v78.11,49.32
N$33  (via drill 0.35)
  Top 0.254: v80.01,49.32 80.5,49.81 J1.31
  Bottom 0.254: R12.3 79.46,48.77 v80.01,49.32
N$34  (via drill 0.35)
  Top 0.254: v68.26,49.32 67.8,49.78 J1.26
  Bottom 0.254: R11.2 68.81,48.77 v68.26,49.32
N$35  (via drill 0.35)
  Top 0.254: v67.31,49 65.72,50.59 65.72,52.49 65.58,52.49 J1.25
  Bottom 0.254: R11.1 68.02,48.29 v67.31,49
N$36  (via drill 0.35)
  Top 0.254: v60.96,49 62.72,50.76 J1.24
  Bottom 0.254: R10.4 60.26,48.29 v60.96,49
N$37  (via drill 0.35)
  Top 0.254: v37.78,49.32 37.32,49.78 J1.14
  Bottom 0.254: R8.2 38.34,48.77 v37.78,49.32
N$38  (via drill 0.35)
  Top 0.254: v39.69,49.32 39.86,49.49 J1.15
  Bottom 0.254: R8.3 39.13,48.77 v39.69,49.32
N$39  (via drill 0.35)
  Top 0.254: v40.64,49 42.4,50.76 J1.16
  Bottom 0.254: R8.4 39.94,48.29 v40.64,49
N$40
  Bottom 0.254: R12.4 80.26,48.29 80.96,49 80.96,51.71 J1.32
N$41
  Bottom 0.305: R13.8 75.18,48.29 78.42,51.54 78.42,52.81 77.96,52.35 J1.33
N$42
  Bottom 0.305: R13.7 74.38,48.77 75.42,49.81 J1.34
N$43
  Bottom 0.305: R13.6 73.58,48.77 72.88,49.46 J1.35
N$44
  Bottom 0.305: R13.5 72.78,48.29 70.34,50.73 J1.36
N$45
  Bottom 0.305: R14.8 65.33,48.29 67.8,50.76 J1.37
N$46
  Bottom 0.305: R14.7 64.53,48.77 65.26,49.49 J1.38
N$47
  Bottom 0.305: R14.6 63.73,48.77 62.72,49.78 J1.39
N$48
  Bottom 0.305: R14.5 62.94,48.29 60.18,51.05 J1.40
N$49
  Bottom 0.305: R15.8 55.17,48.29 57.64,50.76 J1.41
N$50
  Bottom 0.305: R15.7 54.38,48.77 55.1,49.49 J1.42
N$51
  Bottom 0.305: R15.6 53.58,48.77 52.56,49.78 J1.43
N$52
  Bottom 0.305: R15.5 52.77,48.29 50.02,51.05 J1.44
N$53
  Bottom 0.305: R16.8 45.02,48.29 47.48,50.76 J1.45
N$54
  Bottom 0.305: R16.7 44.22,48.77 44.94,49.49 J1.46
N$55
  Bottom 0.305: R16.6 43.41,48.77 42.4,49.78 J1.47
N$56
  Bottom 0.305: R19.5 12.13,48.29 9.38,51.05 J1.60
N$57
  Bottom 0.305: R19.6 12.94,48.77 11.92,49.78 J1.59
N$58
  Bottom 0.305: R19.7 13.73,48.77 14.46,49.49 J1.58
N$59
  Bottom 0.305: R19.8 14.54,48.29 17,50.76 J1.57
N$60
  Bottom 0.305: R18.5 21.98,48.29 19.54,50.73 J1.56
N$61
  Bottom 0.305: R18.6 22.78,48.77 22.08,49.46 J1.55
N$62
  Bottom 0.305: R18.7 23.58,48.77 24.62,49.81 J1.54
N$63
  Bottom 0.305: R18.8 24.38,48.29 27.16,51.08 J1.53
N$64
  Bottom 0.305: R17.5 32.14,48.29 29.7,50.73 J1.52
N$65
  Bottom 0.305: R17.6 32.94,48.77 32.24,49.46 J1.51
N$66
  Bottom 0.305: R17.7 33.74,48.77 34.78,49.81 J1.50
N$67
  Bottom 0.305: R17.8 34.54,48.29 37.32,51.08 J1.49
N$68
  Bottom 0.305: R16.5 42.62,48.29 39.86,51.05 J1.48
N$69  (via drill 3.2)
  other vias: 8.5,5.5
N$70  (via drill 3.2)
  other vias: 8.5,42
N$71  (via drill 3.2)
  other vias: 76.5,5.5
N$72  (via drill 3.2)
  other vias: 76.5,42
N$73
  Bottom 0.254: U1.37 50.16,35.74 R20.2
N$75  (via drill 0.35)
  Top 0.254: v24.51,4.45 24.51,14.1 25.91,15.5 39.37,15.5 42.08,12.78 43.39,12.78 43.69,13.08 43.69,14.61 36.2,22.1 v32.38,22.1
  Bottom 0.254: U1.94 32.99,22.1 v32.38,22.1 28.11,22.1 R21.1 | S1.1 S1.2 23.91,3.85 v24.51,4.45
SHIELD
  Bottom 0.508: X1.GND4 36.76,1.45 C1.1 | X1.GND3 40,1.9 X1.GND4 | X1.GND2 45,1.9 X1.GND1 X1.GND4
SWDCLK  (via drill 0.35)
  Top 0.254: v40.64,16.32 40.41,16.55 13.55,16.55 10.54,19.56 10.54,19.6 SWD.4
  Bottom 0.254: U1.76 40.64,17.02 v40.64,16.32
SWDIO  (via drill 0.35)
  Top 0.254: v42.86,13.44 42.23,13.44 39.69,15.98 11.24,15.98 8.89,18.33 SWD.2
  Bottom 0.254: U1.72 44.8,18.62 45.26,18.15 45.26,14.37 44.34,13.44 v42.86,13.44
SWO  (via drill 0.35)
  Top 0.254: v30.1,18.61 14.07,18.61 SWD.6
  Bottom 0.254: U1.89 33.03,18.61 v30.1,18.61